# EAGLE schematic shiftregister555timer (EAGLE 6.6.0)
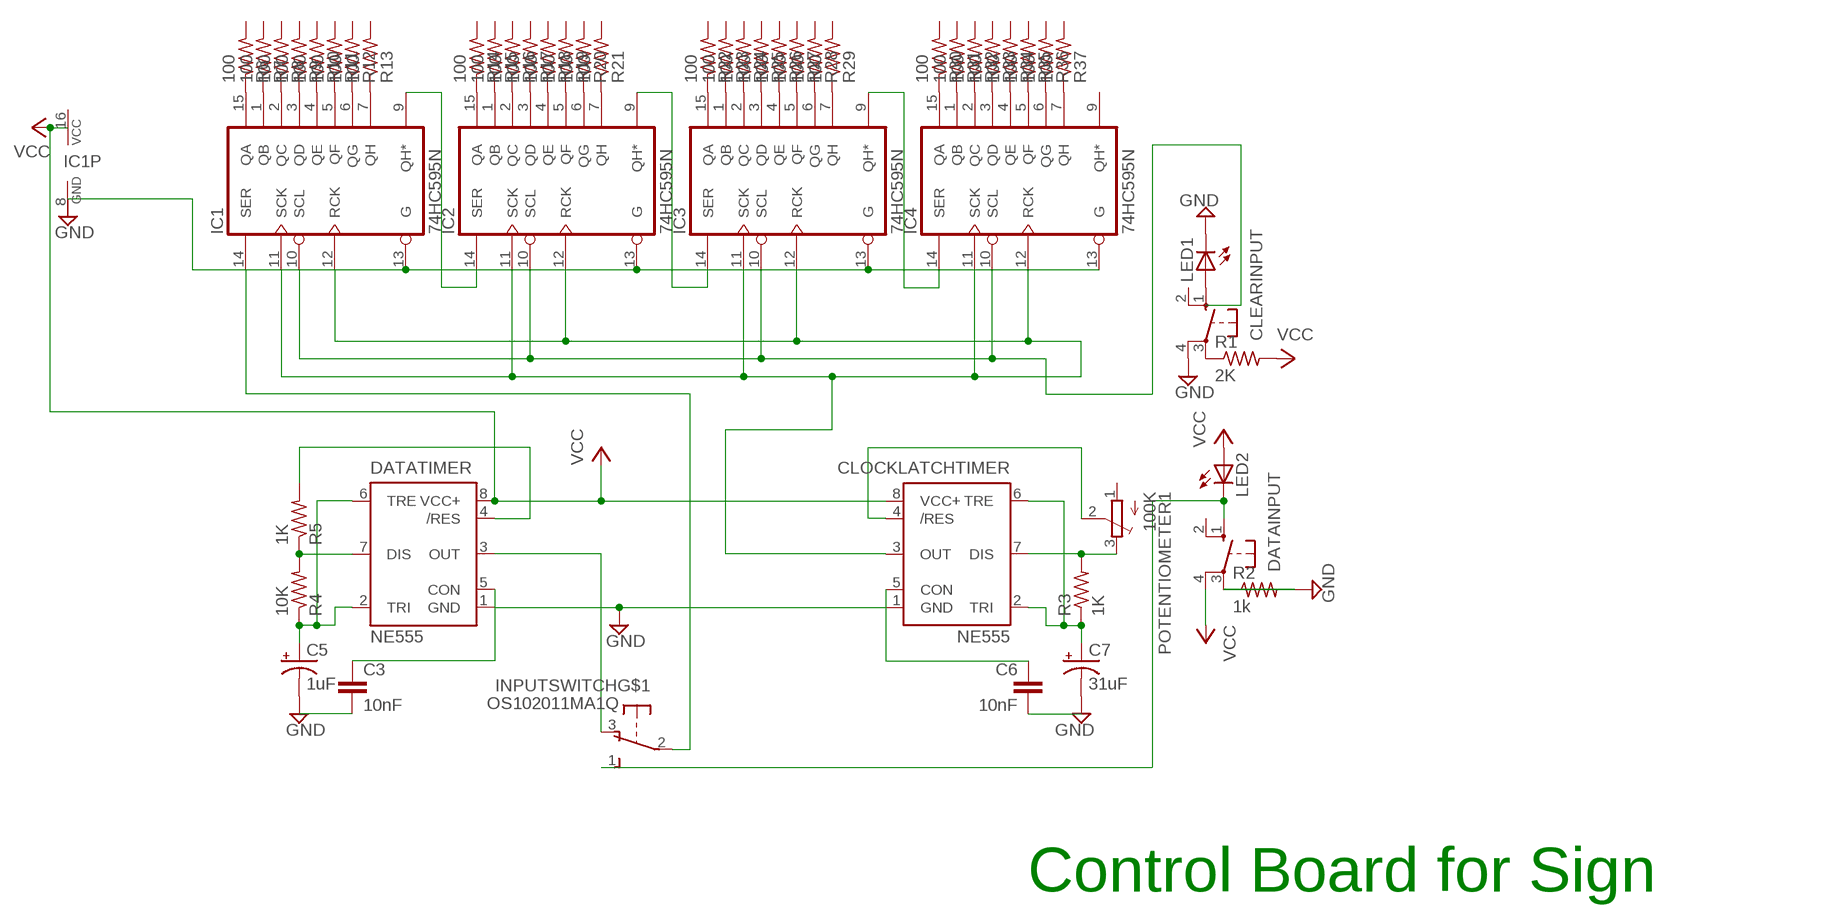
[diagram p0: schematic, sheet 1]

## Parts
C3  10nF  C2,5-3  [C2.5-3]
C5  1uF  CPOL-USUD-10X10  [UD-10X10_NICHICON]
C6  10nF  C2,5-3  [C2.5-3]
C7  31uF  CPOL-USUD-10X10  [UD-10X10_NICHICON]
CLEARINPUT  40-XX  [B3F-40XX]
CLOCKLATCHTIMER  NE555  [DIL-08]
DATAINPUT  40-XX  [B3F-40XX]
DATATIMER  NE555  [DIL-08]
IC1  74HC595N  [DIL16]
IC2  74HC595N  [DIL16]
IC3  74HC595N  [DIL16]
IC4  74HC595N  [DIL16]
INPUTSWITCH  OS102011MA1Q  [OS102011MA1Q]
LED1  LED3MM  [LED3MM]
LED2  LED3MM  [LED3MM]
POTENTIOMETER1  100K  TRIMPOT3386  [TRIM-3386]
R1  2K  R-US_0204/5  [0204/5]
R2  1k  R-US_0204/5  [0204/5]
R3  1K  R-US_0204/5  [0204/5]
R4  10K  R-US_0204/5  [0204/5]
R5  1K  R-US_0204/5  [0204/5]
R6  100  R-US_0204/5  [0204/5]
R7  100  R-US_0204/5  [0204/5]
R8  100  R-US_0204/5  [0204/5]
R9  100  R-US_0204/5  [0204/5]
R10  100  R-US_0204/5  [0204/5]
R11  100  R-US_0204/5  [0204/5]
R12  100  R-US_0204/5  [0204/5]
R13  100  R-US_0204/5  [0204/5]
R14  100  R-US_0204/5  [0204/5]
R15  100  R-US_0204/5  [0204/5]
R16  100  R-US_0204/5  [0204/5]
R17  100  R-US_0204/5  [0204/5]
R18  100  R-US_0204/5  [0204/5]
R19  100  R-US_0204/5  [0204/5]
R20  100  R-US_0204/5  [0204/5]
R21  100  R-US_0204/5  [0204/5]
R22  100  R-US_0204/5  [0204/5]
R23  100  R-US_0204/5  [0204/5]
R24  100  R-US_0204/5  [0204/5]
R25  100  R-US_0204/5  [0204/5]
R26  100  R-US_0204/5  [0204/5]
R27  100  R-US_0204/5  [0204/5]
R28  100  R-US_0204/5  [0204/5]
R29  100  R-US_0204/5  [0204/5]
R30  100  R-US_0204/5  [0204/5]
R31  100  R-US_0204/5  [0204/5]
R32  100  R-US_0204/5  [0204/5]
R33  100  R-US_0204/5  [0204/5]
R34  100  R-US_0204/5  [0204/5]
R35  100  R-US_0204/5  [0204/5]
R36  100  R-US_0204/5  [0204/5]
R37  100  R-US_0204/5  [0204/5]

## Nets
GND: C5.- C7.- CLEARINPUT.4(P1) CLOCKLATCHTIMER.1(GND) DATATIMER.1(GND) IC1.13(G) IC2.13(G) IC3.13(G) IC4.13(G) LED1.K(C) R2.1
N$1: IC2.9(QH*) IC3.14(SER)
N$2: CLOCKLATCHTIMER.3(OUT) IC1.11(SCK) IC2.11(SCK) IC3.11(SCK) IC4.11(SCK)
N$3: IC1.10(SCL) IC2.10(SCL) IC3.10(SCL) IC4.10(SCL)
N$4: IC1.12(RCK) IC2.12(RCK) IC3.12(RCK) IC4.12(RCK)
N$5: CLEARINPUT.1(S) LED1.A
N$6: DATATIMER.3(OUT) INPUTSWITCH.3(O)
N$7: CLEARINPUT.3(P) R1.1
N$8: DATAINPUT.1(S) INPUTSWITCH.1(S) LED2.K(C)
N$9: DATAINPUT.3(P) R2.2
N$10: IC1.14(SER) INPUTSWITCH.2(P)
N$11: DATATIMER.4(/RES) R5.2
N$12: IC3.9(QH*) IC4.14(SER)
N$13: IC1.9(QH*) IC2.14(SER)
N$14: DATATIMER.7(DIS) R4.2 R5.1
N$15: C5.+ DATATIMER.2(TRI) DATATIMER.6(TRE) R4.1
N$16: CLOCKLATCHTIMER.4(/RES) POTENTIOMETER1.2(S)
N$17: C3.1 DATATIMER.5(CON)
N$18: C3.2
N$19: POTENTIOMETER1.3(E) R3.2
N$20: C7.+ R3.1
N$21: C6.1 CLOCKLATCHTIMER.5(CON)
N$22: C6.2
N$23: IC1.15(QA) R6.1
N$24: IC1.1(QB) R7.1
N$25: IC1.2(QC) R8.1
N$26: IC1.3(QD) R9.1
N$27: IC1.4(QE) R10.1
N$28: IC1.5(QF) R11.1
N$29: IC1.6(QG) R12.1
N$30: IC1.7(QH) R13.1
VCC: CLOCKLATCHTIMER.8(VCC+) DATAINPUT.4(P1) DATATIMER.8(VCC+) LED2.A R1.2
Unconnected: CLEARINPUT.2(S1) CLOCKLATCHTIMER.2(TRI) CLOCKLATCHTIMER.6(TRE) CLOCKLATCHTIMER.7(DIS) DATAINPUT.2(S1) IC2.1(QB) IC2.2(QC) IC2.3(QD) IC2.4(QE) IC2.5(QF) IC2.6(QG) IC2.7(QH) IC2.15(QA) IC3.1(QB) IC3.2(QC) IC3.3(QD) IC3.4(QE) IC3.5(QF) IC3.6(QG) IC3.7(QH) IC3.15(QA) IC4.1(QB) IC4.2(QC) IC4.3(QD) IC4.4(QE) IC4.5(QF) IC4.6(QG) IC4.7(QH) IC4.9(QH*) IC4.15(QA) INPUTSWITCH.MT1(MT) INPUTSWITCH.MT2(MT) POTENTIOMETER1.1(A) R6.2 R7.2 R8.2 R9.2 R10.2 R11.2 R12.2 R13.2 R14.1 R14.2 R15.1 R15.2 R16.1 R16.2 R17.1 R17.2 R18.1 R18.2 R19.1 R19.2 R20.1 R20.2 R21.1 R21.2 R22.1 R22.2 R23.1 R23.2 R24.1 R24.2 R25.1 R25.2 R26.1 R26.2 R27.1 R27.2 R28.1 R28.2 R29.1 R29.2 R30.1 R30.2 R31.1 R31.2 R32.1 R32.2 R33.1 R33.2 R34.1 R34.2 R35.1 R35.2 R36.1 R36.2 R37.1 R37.2

## Notes on the sheet
- Control Board for Sign

## Power pins joined to a net without a drawn wire
GND: IC1.8(GND) IC2.8(GND) IC3.8(GND) IC4.8(GND)
VCC: IC1.16(VCC) IC2.16(VCC) IC3.16(VCC) IC4.16(VCC)

## Library data of the parts
C3 C6 = capacitor-wima:C: CAPACITOR naming: grid - package width
C5 C7 = rcl:CPOL-US: POLARIZED CAPACITOR, American symbol
CLEARINPUT DATAINPUT = adafruit:40-XX: OMRON SWITCH; MF: OMRON COMPONENTS USA; MPN: B3F-4000; OC_FARNELL: 176434; OC_NEWARK: 36K3105
CLOCKLATCHTIMER DATATIMER = st-microelectronics:NE555: General purpose bipolar Timer; MF: Arrow Electronics; MPN: NE555N; OC_FARNELL: 1467742; OC_NEWARK: 89K1486
IC1-IC4 = 74xx-eu:74*595: 8-bit SHIFT REGISTER, output latch
INPUTSWITCH = adafruit:OS102011MA1Q: OS10201MA1Q through-hole right angle switch http://www.ladyada.net/library/eagle
LED1 LED2 = adafruit:LED: LED OSRAM: - CHIPLED LG R971, LG N971, LY N971, LG Q971, LY Q971, LO R971, LY R971 LH N974, LH R974 LS Q976, LO Q976, LY Q976 LO Q996 - Hyper CHIPLED LW Q18S LB Q993, LB Q99A, LB R99A - SideLED LS A670, LO A670, LY A670, LG A670, LP A670 LB A673, LV A673, LT A673, LW A673 LH A674 LY A675 LS A676, LA A676, LO A676, LY A676, LW A676 LS A679, LY A679, LG A679 - Hyper Micro SIDELED® LS Y876, LA Y876, LO Y876, LY Y876 LT Y87S - SmartLED LW L88C, LW L88S LB L89C, LB L89S, LG L890 LS L89K, LO L89K, LY L89K LS L896, LA L896, LO L896, LY L896 - TOPLED LS T670, LO T670, LY T670, LG T670, LP T670 LSG T670, LSP T670, LSY T670, LOP T670, LYG T670 LG T671, LOG T671, LSG T671 LB T673, LV T673, LT T673, LW T673 LH T674 LS T676, LA T676, LO T676, LY T676, LB T676, LH T676, LSB T676, LW T676 LB T67C, LV T67C, LT T67C, LS T67K, LO T67K, LY T67K, LW E67C LS E67B, LA E67B, LO E67B, LY E67B, LB E67C, LV E67C, LT E67C LW T67C LS T679, LY T679, LG T679 LS T770, LO T770, LY T770, LG T770, LP T770 LB T773, LV T773, LT T773, LW T773 LH T774 LS E675, LA E675, LY E675, LS T675 LS T776, LA T776, LO T776, LY T776, LB T776 LHGB T686 LT T68C, LB T68C - Hyper Mini TOPLED® LB M676 - Mini TOPLED Santana® LG M470 LS M47K, LO M47K, LY M47K Source: http://www.osram.convergy.de/
POTENTIOMETER1 = adafruit:TRIMPOT: SMT trimmer potentiometer part number TC33X http://www.ladyada.net/library/eagle
R1-R37 = rcl:R-US_: RESISTOR, American symbol